# EAGLE schematic Phototransistor Mount (EAGLE 8.7.0)
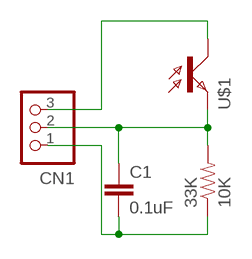
[diagram p0: schematic, sheet 1]

## Parts
33K  10K  RESISTOR0603-RES  [0603-RES]
C1  0.1uF  CAP0603-CAP  [0603-CAP]
CN1  B3B-PH-K-S  [B3B-PH-K-S]
U$1  ALS  [SMD]

## Nets
N$1: CN1.3 U$1.C
N$2: 33K.1 C1.2 CN1.1
OUT: 33K.2 C1.1 CN1.2 U$1.E

## Library data of the parts
33K = SparkFun-Passives:RESISTOR: Resistor Basic schematic elements and footprints for 0603, 1206, and PTH resistors.
C1 = SparkFun-Capacitors:CAP: Capacitor Standard 0603 ceramic capacitor, and 0.1" leaded capacitor.
CN1 = jst-ph:B3B-PH-*: Wire-to-Board 2.0mm pitch top mount connector Source: http://www.jst-mfg.com/product/pdf/jpn/PH.pdf http://www.jst-mfg.com/product/detail.php?series=199
U$1 = phototransitor-ALS-PT19-315CL177TR8:ALS